# Altium project PMP20873E1.PrjPcb (part 2 of 4)

## Sheet PMP20873E1_Control.SchDoc: CONTROLLER
size 431 x 279 mm; Date: Not shown in title block; ApprovedBy: Not shown in title block; CheckedBy: Not shown in title block; Author: Not shown in title block; CompanyName: Not shown in title block; DrawnBy: Eric Faraci; Engineer: Not shown in title block; Organization: Not shown in title block; Address1: Not shown in title block; Address2: Not shown in title block; Address3: Not shown in title block; Address4: Not shown in title block; DocumentNumber: 3; Revision: Use project parameter SCH_Rev; SheetNumber: 3; SheetTotal: 8; PageSetup: Record=PageOptions|CenterHorizontal=True|CenterVertical=True|PrintScale=0.96|XCorrection=1.00|YCorrection=1.00|PrintKind=0|BorderSize=5000000|LeftOffset=0|BottomOffset=0|Orientation=2|PaperLength=1000|PaperWidth=1000|Scale=100|PaperSource=15|PrintQuality=600|MediaType=1|DitherType=10|PaperKind=11x17|PrintScaleMode=1; CurrentTime: Not shown in title block; CurrentDate: Not shown in title block; Time: Not shown in title block; DocumentFullPathAndName: Not shown in title block; DocumentName: Not shown in title block; ModifiedDate: Not shown in title block; ImagePath: Not shown in title block
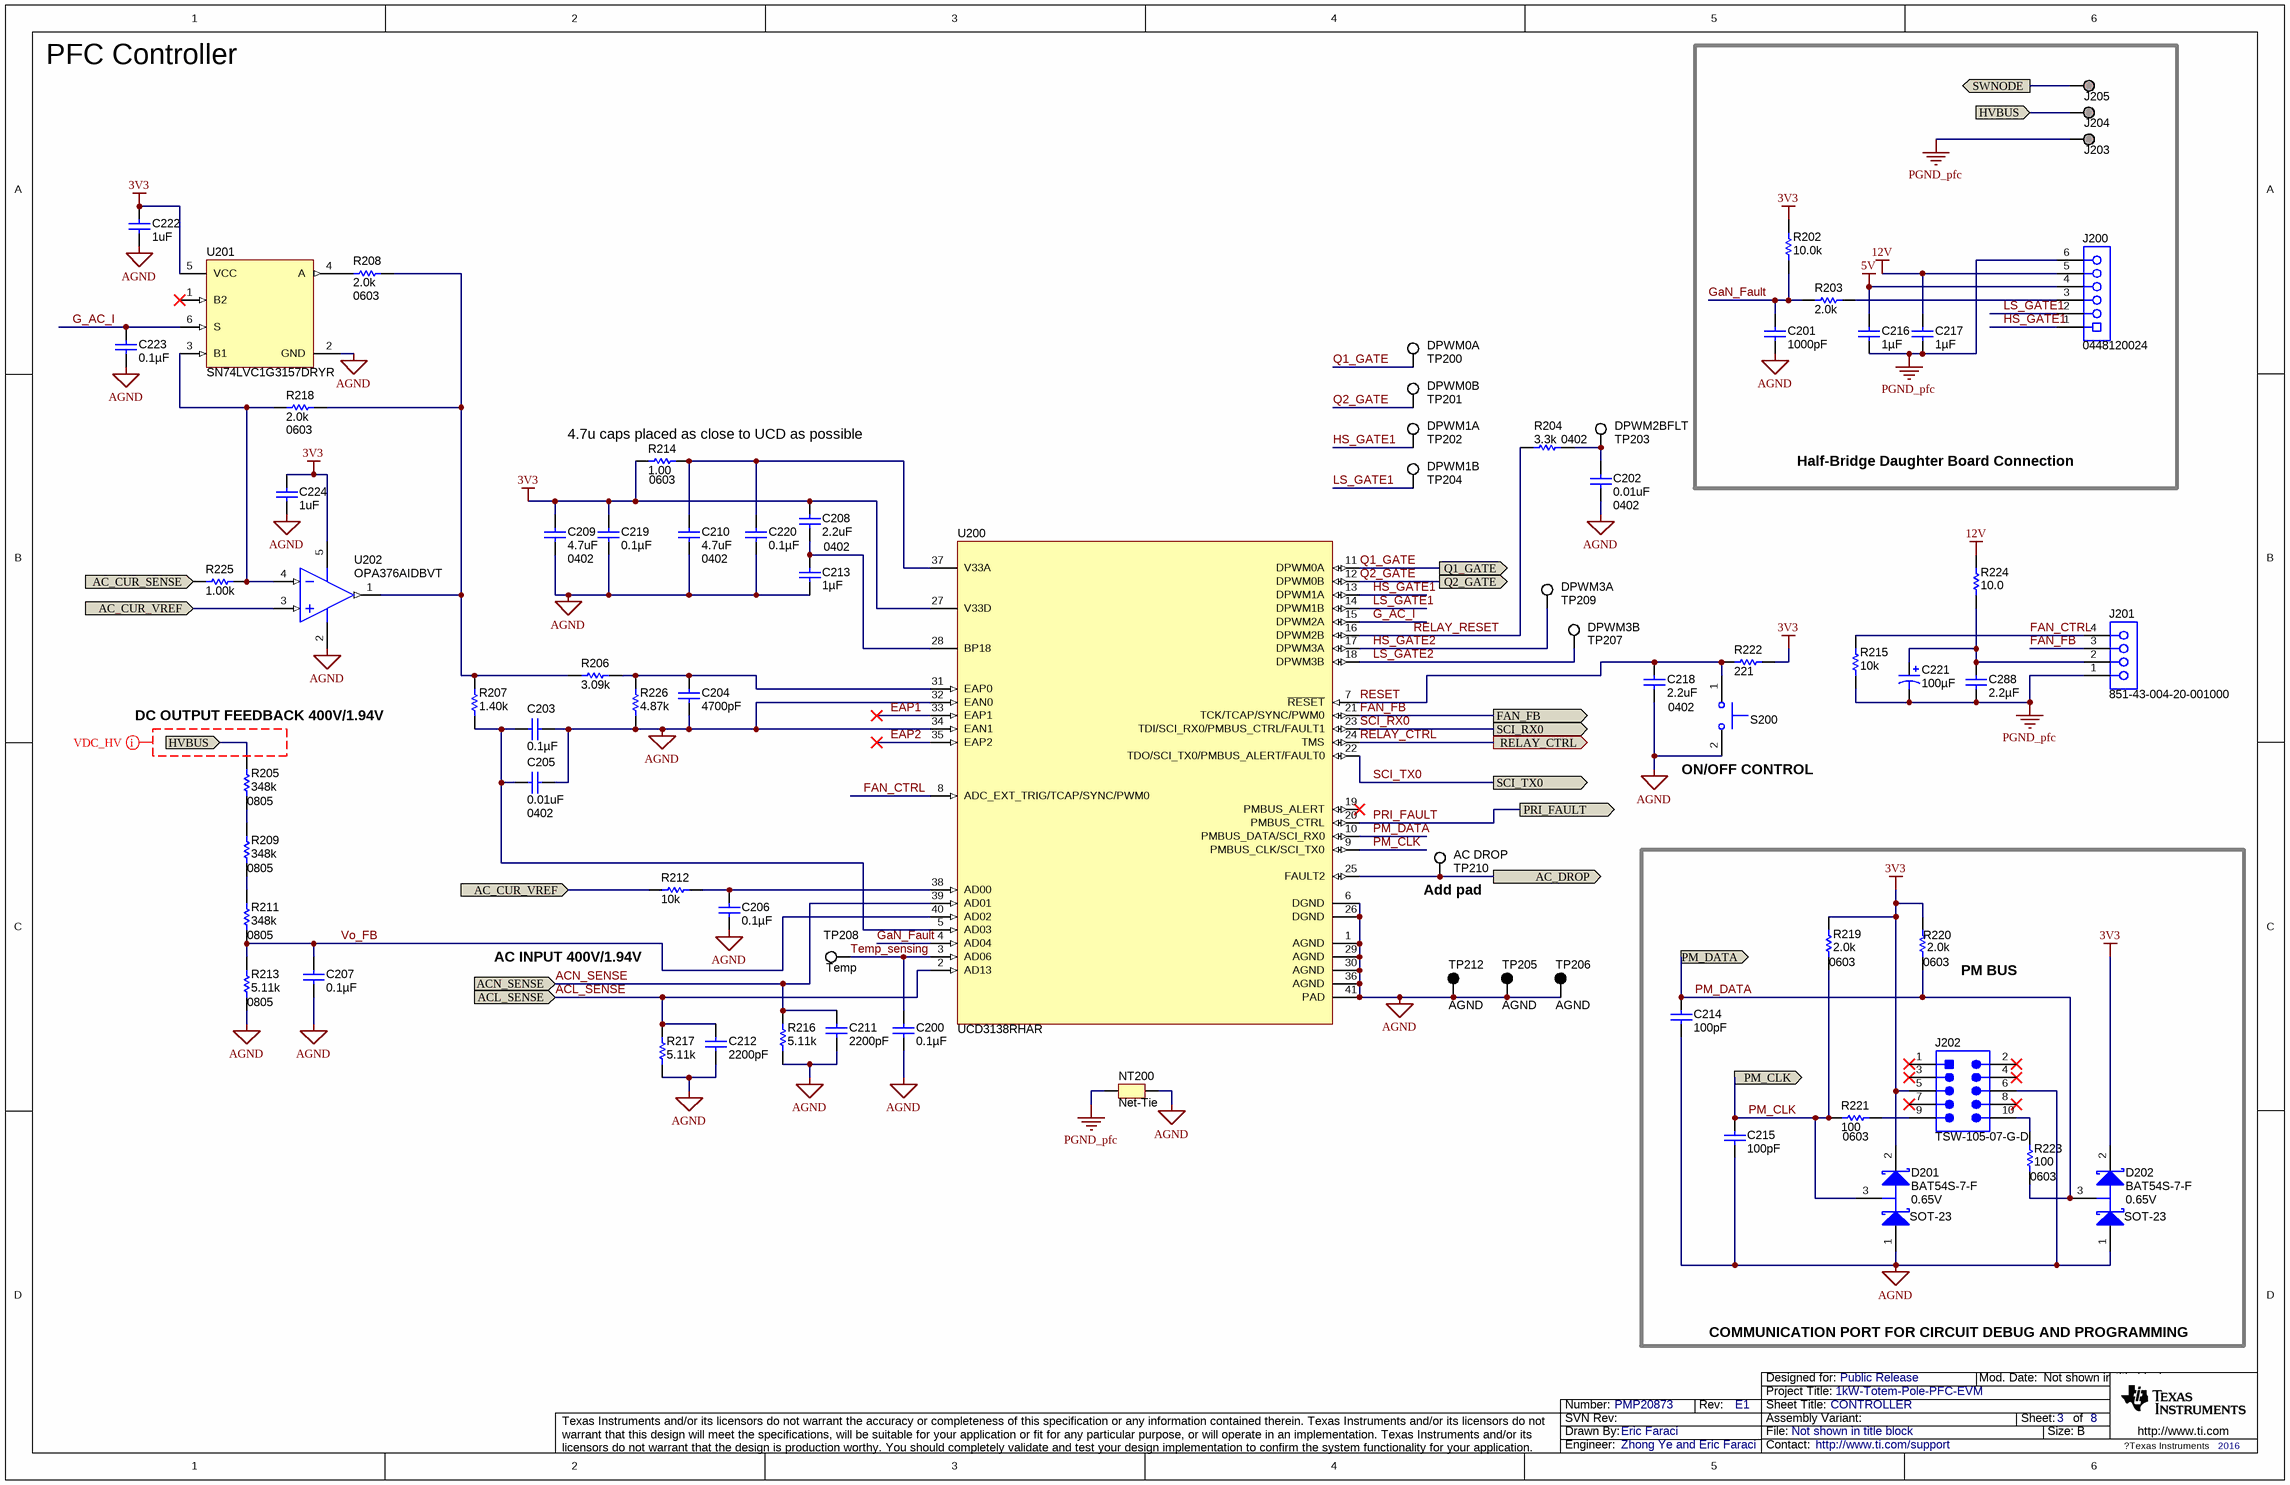
[diagram p1: PMP20873E1_Control.SchDoc]

### Parts
C200  ValueDisplayed: 0.1µF  [0402]  (hidden comment: GRM155R60J104KA01D)
C201  ValueDisplayed: 1000pF  [0402]  (hidden comment: GRM155R61A102KA01D)
C202  ValueDisplayed: 0.01uF  [0402]  (hidden comment: GRM155R70J103KA01D)
C203  ValueDisplayed: 0.1µF  [0402]  (hidden comment: GRM155R60J104KA01D)
C204  ValueDisplayed: 4700pF  [0402]  (hidden comment: GRM155R60J472KA01D)
C205  ValueDisplayed: 0.01uF  [0402]  (hidden comment: GRM155R70J103KA01D)
C206  ValueDisplayed: 0.1µF  [0402]  (hidden comment: GRM155R60J104KA01D)
C207  ValueDisplayed: 0.1µF  [0603]  (hidden comment: GCM188R71H104KA57D)
C208  ValueDisplayed: 2.2uF  [0402]  (hidden comment: C1005X5R1A225K050BC)
C209  value 4.7uF  [0402]  (hidden comment: CL05A475MQ5NRNC)
C210  value 4.7uF  [0402]  (hidden comment: CL05A475MQ5NRNC)
C211  ValueDisplayed: 2200pF  [0603]  (hidden comment: C1608X7R1H222K)
C212  ValueDisplayed: 2200pF  [0603]  (hidden comment: C1608X7R1H222K)
C213  ValueDisplayed: 1µF  [0402]  (hidden comment: GRM155R61A105KE15D)
C214  ValueDisplayed: 100pF  [0402]  (hidden comment: GRM1555C1H101JA01D)
C215  ValueDisplayed: 100pF  [0402]  (hidden comment: GRM1555C1H101JA01D)
C216  ValueDisplayed: 1µF  [0603]  (hidden comment: C1608X7R1E105K080AB)
C217  ValueDisplayed: 1µF  [0603]  (hidden comment: C1608X7R1E105K080AB)
C218  ValueDisplayed: 2.2uF  [0402]  (hidden comment: C1005X5R1A225K050BC)
C219  ValueDisplayed: 0.1µF  [0402]  (hidden comment: GRM155R60J104KA01D)
C220  ValueDisplayed: 0.1µF  [0402]  (hidden comment: GRM155R60J104KA01D)
C221  ValueDisplayed: 100µF  [7343-43]  (hidden comment: T495X107K016ATE100)
C222  ValueDisplayed: 1uF  [0603]  (hidden comment: C1608X7R1E105K080AB)
C223  ValueDisplayed: 0.1µF  [0603]  (hidden comment: GCM188R71H104KA57D)
C224  ValueDisplayed: 1uF  [0603]  (hidden comment: C1608X7R1E105K080AB)
C288  ValueDisplayed: 2.2µF  [1206]  (hidden comment: 12063D225KAT2A)
D201  BAT54S-7-F  value 0.65V  [SOT-23]
D202  BAT54S-7-F  value 0.65V  [SOT-23]
J200  0448120024  [Molex_0448120024]
J201  851-43-004-20-001000  [CONN_851-43-004-20-001000]
J202  TSW-105-07-G-D  [TSW-105-07-G-D]
J203  Suggest using a net name here  [Mill-Max_0312-0-15-15-34-27-10-0]  (value not drawn)
J204  Suggest using a net name here  [Mill-Max_0312-0-15-15-34-27-10-0]  (value not drawn)
J205  Suggest using a net name here  [Mill-Max_0312-0-15-15-34-27-10-0]  (value not drawn)
NT200  Net-Tie  [Net-Tie_50milWide_30milLong]  (net tie, no BOM)
R202  ValueDisplayed: 10.0k  [0402]  (hidden comment: ERJ-2RKF1002X)
R203  value 2.0k  [0402]  (hidden comment: CRCW04022K00JNED)
R204  value 3.3k  [0402]  (hidden comment: CRCW04023K30JNED)
R205  value 348k  PackageReference: 0805  [0805_HV]  (hidden comment: RT0805BRD07348KL)
R206  ValueDisplayed: 3.09k  [0402]  (hidden comment: ERA-2AEB3091X)
R207  value 1.40k  [0402]  (hidden comment: CRCW04021K40FKED)
R208  value 2.0k  [0603]  (hidden comment: CRCW06032K00JNEA)
R209  value 348k  PackageReference: 0805  [0805_HV]  (hidden comment: RT0805BRD07348KL)
R211  value 348k  PackageReference: 0805  [0805_HV]  (hidden comment: RT0805BRD07348KL)
R212  value 10k  [0402]  (hidden comment: CRCW040210K0JNED)
R213  value 5.11k  PackageReference: 0805  [0805_HV]  (hidden comment: RT0805BRD075K11L)
R214  value 1.00  [0603]  (hidden comment: CRCW06031R00FKEA)
R215  value 10k  [0402]  (hidden comment: CRCW040210K0JNED)
R216  ValueDisplayed: 5.11k  [0603]  (hidden comment: RT0603BRD075K11L)
R217  ValueDisplayed: 5.11k  [0603]  (hidden comment: RT0603BRD075K11L)
R218  value 2.0k  [0603]  (hidden comment: CRCW06032K00JNEA)
R219  value 2.0k  [0603]  (hidden comment: CRCW06032K00JNEA)
R220  value 2.0k  [0603]  (hidden comment: CRCW06032K00JNEA)
R221  value 100  [0603]  (hidden comment: CRCW0603100RJNEA)
R222  ValueDisplayed: 221  [0402]  (hidden comment: CRCW0402221RFKED)
R223  value 100  [0603]  (hidden comment: CRCW0603100RJNEA)
R224  ValueDisplayed: 10.0  [1206]  (hidden comment: ERJ-8ENF10R0V)
R225  ValueDisplayed: 1.00k  [0603]  (hidden comment: RC0603FR-071KL)
R226  ValueDisplayed: 4.87k  [0402]  (hidden comment: ERA-2AEB4871X)
S200  SKRKAEE010  [SW_SKRKAEE010]  (value not drawn)
TP200  DPWM0A  [Keystone5002]
TP201  DPWM0B  [Keystone5002]
TP202  DPWM1A  [Keystone5002]
TP203  DPWM2BFLT  [Keystone5002]
TP204  DPWM1B  [Keystone5002]
TP205  AGND  [Keystone5001]
TP206  AGND  [Keystone5001]
TP207  DPWM3B  [Keystone5002]
TP208  Temp  [Keystone5002]
TP209  DPWM3A  [Keystone5002]
TP210  AC DROP  [Keystone5002]
TP212  AGND  [Keystone5001]
U200  UCD3138RHAR  [RHA0040B]
U201  SN74LVC1G3157DRYR  [DRY0006A]
U202  OPA376AIDBVT  [DBV0005A_N]

### Blocks framed on the sheet
Half-Bridge Daughter Board Connection: C201 C216 C217 J200 J203-J205 R202 R203

### Ports
AC_CUR_SENSE, AC_CUR_VREF, AC_DROP, ACL_SENSE, ACN_SENSE, FAN_FB (out), HVBUS, PM_CLK, PM_DATA, PRI_FAULT (out), Q1_GATE (out), Q2_GATE (out), RELAY_CTRL (out), SCI_RX0 (out), SCI_TX0 (out), SWNODE

### Nets
3V3: C208.1 C209.1 C219.1 C222.2 C224.2 D201.2(K) D202.2(K) J202.5 R202.2 R214.2 R219.2 R220.2 R222.2 U200.27(V33D) U201.5(VCC) U202.5(V+)
5V: C216.2 J200.4
12V: C217.2 J200.5 R224.2
AGND: C200.1 C201.2 C202.1 C203.2 C204.2 C205.2 C206.1 C207.2 C209.2 C210.2 C211.2 C212.2 C213.2 C214.2 C215.2 C218.2 C219.2 C220.2 C222.1 C223.2 C224.1 D201.1(A) D202.1(A) J202.6 NT200.2 R213.1 R216.1 R217.1 R226.1 S200.2 TP205.1 TP206.1 TP212.1 U200.1(AGND) U200.6(DGND) U200.26(DGND) U200.29(AGND) U200.30(AGND) U200.32(EAN0) U200.34(EAN1) U200.36(AGND) U200.41(PAD) U201.2(GND) U202.2(V-)
PGND_pfc: C216.1 C217.1 C221.2(-) C288.1 J200.6 J201.1 J203.1 NT200.1 R215.1
AC_CUR_SENSE: R225.1 ; port AC_CUR_SENSE
AC_CUR_VREF: R212.2 U202.3(IN+) ; port AC_CUR_VREF
AC_DROP: TP210.1 U200.25(FAULT2) ; port AC_DROP
ACL_SENSE: C212.1 R217.2 U200.2(AD13) ; port ACL_SENSE
ACN_SENSE: C211.1 R216.2 U200.39(AD01) ; port ACN_SENSE
EAP1: U200.33(EAP1)
EAP2: U200.35(EAP2)
FAN_CTRL: J201.4 R215.2 U200.8(ADC_EXT_TRIG/TCAP/SYNC/PWM0)
FAN_FB: J201.3 U200.21(TCK/TCAP/SYNC/PWM0) ; port FAN_FB
G_AC_I: C223.1 U200.15(DPWM2A) U201.6(S)
GaN_Fault: C201.1 R202.1 R203.1 U200.4(AD04)
HS_GATE1: J200.1 TP202.1 U200.13(DPWM1A)
HS_GATE2: TP209.1 U200.17(DPWM3A)
HVBUS: J204.1 R205.2 ; port HVBUS
LS_GATE1: J200.2 TP204.1 U200.14(DPWM1B)
LS_GATE2: TP207.1 U200.18(DPWM3B)
PM_CLK: C215.1 D201.3(C) R219.1 R221.1 U200.9(PMBUS_CLK/SCI_TX0) ; port PM_CLK
PM_DATA: C214.1 D202.3(C) R220.1 R223.1 U200.10(PMBUS_DATA/SCI_RX0) ; port PM_DATA
PRI_FAULT: U200.20(PMBUS_CTRL) ; port PRI_FAULT
Q1_GATE: TP200.1 U200.11(DPWM0A) ; port Q1_GATE
Q2_GATE: TP201.1 U200.12(DPWM0B) ; port Q2_GATE
RELAY_CTRL: U200.24(TMS) ; port RELAY_CTRL
RELAY_RESET: R204.1 U200.16(DPWM2B)
RESET: C218.1 R222.1 S200.1 U200.7(~{RESET})
SCI_RX0: U200.23(TDI/SCI_RX0/PMBUS_CTRL/FAULT1) ; port SCI_RX0
SCI_TX0: U200.22(TDO/SCI_TX0/PMBUS_ALERT/FAULT0) ; port SCI_TX0
SWNODE: J205.1 ; port SWNODE
Temp_sensing: C200.2 TP208.1 U200.3(AD06)
Vo_FB: C207.1 R211.1 R213.2 U200.40(AD02)
NetC202_2: C202.2 R204.2 TP203.1
NetC203_1: C203.1 C205.1 R207.1 U200.5(AD03)
NetC204_1: C204.1 R206.2 R226.2 U200.31(EAP0)
NetC206_2: C206.2 R212.1 U200.38(AD00)
NetC208_2: C208.2 C213.1 U200.28(BP18)
NetC210_1: C210.1 C220.1 R214.1 U200.37(V33A)
NetC221_1: C221.1(+) C288.2 J201.2 R224.1
NetJ200_3: J200.3 R203.2
NetJ202_9: J202.9 R221.2
NetJ202_10: J202.10 R223.2
NetR205_1: R205.1 R209.2
NetR206_1: R206.1 R207.2 R208.1 R218.1 U202.1(OUT)
NetR208_2: R208.2 U201.4(A)
NetR209_1: R209.1 R211.2
NetR218_2: R218.2 R225.2 U201.3(B1) U202.4(IN-)

Not connected (* = marked no-connect by the designer): J202 1* 2* 3* 4* 7* 8*; U200 19(PMBUS_ALERT)*; U201 1(B2)*

### Layout directives
net class VDC_HV: (no net found under the mark)

### Notes on the sheet
- PFC Controller
- (near R214) 4.7u caps placed as close to UCD as possible
- (near R205) DC OUTPUT FEEDBACK 400V/1.94V
- (near S200) ON/OFF CONTROL
- (near TP210) Add pad
- AC INPUT 400V/1.94V
- (near R220) PM BUS
- COMMUNICATION PORT FOR CIRCUIT DEBUG AND PROGRAMMING
- Drawn By:
- SVN Rev:
- Number:
- Rev:
- Sheet Title:
- File:
- Project Title:
- Designed for:
- Assembly Variant:
- Mod. Date:
- Sheet:
- Size:
- of
- B
- http://www.ti.com
- Texas Instruments and/or its licensors do not warrant the accuracy or completeness of this specification or any information contained therein. Texas Instruments and/or its licensors do not warrant that this design will meet the specifications, will be suitable for your application or fit for any particular purpose, or will operate in an implementation. Texas Instruments and/or its licensors do not warrant that the design is production worthy. You should completely validate and test your design implementation to confirm the system functionality for your application.
- Engineer:
- Contact:
- ?Texas Instruments

### Library data of the parts
C200 C203 C206 C219 C220 = GRM155R60J104KA01D: CAP, CERM, 0.1uF, 6.3V, +/-10%, X5R, 0402; Manufacturer: MuRata; Polarized: N; CompType: Capacitor; U/M: EA; Cap_F: 0.0000001; Tolerance_%: 10; Value1: Unknown; VDC_V: 6.3; TaMin_C: -55; TaMax_C: 85; SymbolVersion: 2008-07-09; Value: 0.1uF; PartNumber: GRM155R60J104KA01D; PackageReference: 0402; RoHS: Y; Value2: 6.3V; MountType: SMT; Technology: Ceramic; TempCo: X5R; Cap_Case: 0402; Published: 2008-06-19; Publisher: Texas Instruments; LatestRevisionDate: 2014-04-30; ComponentLink1Description: Datasheet link; ComponentLink1URL: http://search.murata.co.jp/Ceramy/PnsearchViewAction.do?HnOFG=ON&HnNFG=ON&SEL_CNT=50&sLang=en&sKey=GRM155R60J104KA01D&x=9&y=9&search=startwith; Supplier 1: Digi-Key; Supplier Part Number 1: GRM155R60J104KA01D-ND; Supplier 2: Mouser; Supplier Part Number 2: 81-GRM155R60J104KA1D
C201 = GRM155R61A102KA01D: CAP, CERM, 1000pF, 10V, +/-10%, X5R, 0402; Manufacturer: MuRata; Polarized: N; CompType: Capacitor; U/M: EA; Cap_F: 0.000000001; Tolerance_%: 10; Value1: Unknown; TaMin_C: -55; TaMax_C: 85; SymbolVersion: 2008-07-09; Value: 1000pF; PartNumber: GRM155R61A102KA01D; PackageReference: 0402; RoHS: Y; VDC_V: 10; Value2: 10V; MountType: SMT; Technology: Ceramic; TempCo: X5R; Cap_Case: 0402; Published: 2008-06-19; Publisher: Texas Instruments; LatestRevisionDate: 2014-04-30; ComponentLink1Description: Datasheet link; ComponentLink1URL: http://search.murata.co.jp/Ceramy/PnsearchViewAction.do?HnOFG=ON&HnNFG=ON&SEL_CNT=50&sLang=en&sKey=GRM155R61A102KA01D&x=9&y=9&search=startwith; Supplier 1: Digi-Key; Supplier Part Number 1: GRM155R61A102KA01D-ND; Supplier 2: Mouser; Supplier Part Number 2: 81-GRM155R61A102KA1D
C202 C205 = GRM155R70J103KA01D: CAP, CERM, 0.01uF, 6.3V, +/-10%, X7R, 0402; Manufacturer: MuRata; Polarized: N; CompType: Capacitor; U/M: EA; Cap_F: 0.00000001; Tolerance_%: 10; Value1: Unknown; VDC_V: 6.3; TaMin_C: -55; TaMax_C: 125; SymbolVersion: 2008-07-09; Value: 0.01uF; PartNumber: GRM155R70J103KA01D; PackageReference: 0402; RoHS: Y; Value2: 6.3V; MountType: SMT; Technology: Ceramic; TempCo: X7R; Cap_Case: 0402; Published: 2008-06-19; Publisher: Texas Instruments; LatestRevisionDate: 2013-05-24; LatestRevisionNote: Changed publisher; ComponentLink1Description: Datasheet link; ComponentLink1URL: http://search.murata.co.jp/Ceramy/PnsearchViewAction.do?HnOFG=ON&HnNFG=ON&SEL_CNT=50&sLang=en&sKey=GRM155R70J103KA01D&x=9&y=9&search=startwith; Supplier 1: Digi-Key; Supplier Part Number 1: GRM155R70J103KA01D-ND; Supplier 2: Mouser; Supplier Part Number 2: 81-GRM155R70J103KA1D
C204 = GRM155R60J472KA01D: CAP, CERM, 4700pF, 6.3V, +/-10%, X5R, 0402; Manufacturer: MuRata; Polarized: N; CompType: Capacitor; U/M: EA; Cap_F: 0.0000000047; Tolerance_%: 10; Value1: Unknown; VDC_V: 6.3; TaMin_C: -55; TaMax_C: 85; SymbolVersion: 2008-07-09; Value: 4700pF; PartNumber: GRM155R60J472KA01D; PackageReference: 0402; RoHS: Y; Value2: 6.3V; MountType: SMT; Technology: Ceramic; TempCo: X5R; Cap_Case: 0402; Published: 2008-06-19; Publisher: Texas Instruments; LatestRevisionDate: 2014-04-30; ComponentLink1Description: Datasheet link; ComponentLink1URL: http://search.murata.co.jp/Ceramy/PnsearchViewAction.do?HnOFG=ON&HnNFG=ON&SEL_CNT=50&sLang=en&sKey=GRM155R60J472KA01D&x=9&y=9&search=startwith; Supplier 1: Digi-Key; Supplier Part Number 1: GRM155R60J472KA01D-ND; Supplier 2: Mouser; Supplier Part Number 2: 81-GRM155R60J472KA1D
C207 C223 = GCM188R71H104KA57D: CAP, CERM, 0.1 µF, 50 V, +/- 10%, X7R, 0603; Manufacturer: MuRata; Polarized: N; CompType: Capacitor; Value: 0.1uF; U/M: EA; Cap_F: 0.0000001; Tolerance_%: 10; ESR_ohm: 0.02; Value1: 0.02 ohm; VDC_V: 50; Value2: 50V; IRMS_A: 1.84; TaMin_C: -55; TaMax_C: 125; AEC Category: Q200; SymbolVersion: 2008-07-09; PartNumber: GCM188R71H104KA57D; PackageReference: 0603; RoHS: Y; MountType: SMT; Technology: Ceramic; TempCo: X7R; Cap_Case: 0603; Published: 2008-06-19; Publisher: Texas Instruments; LatestRevisionDate: 2015-12-09; ComponentLink1Description: Datasheet link; ComponentLink1URL: http://psearch.murata.com/capacitor/product/GCM188R71H104KA57%23.pdf; Supplier 1: Digi-Key; Supplier Part Number 1: 490-4779-1-ND; Supplier 2: Mouser; Supplier Part Number 2: 81-GCM188R71H104KA7D; AEC Qualified: ?
C208 C218 = C1005X5R1A225K050BC: CAP, CERM, 2.2uF, 10V, +/-10%, X5R, 0402; Manufacturer: TDK; Polarized: N; CompType: Capacitor; U/M: EA; Cap_F: 0.0000022; Tolerance_%: 10; Value1: Unknown; TaMin_C: -55; TaMax_C: 85; SymbolVersion: 2008-07-09; Value: 2.2uF; PartNumber: C1005X5R1A225K050BC; PackageReference: 0402; RoHS: Y; VDC_V: 10; Value2: 10V; MountType: SMT; Technology: Ceramic; TempCo: X5R; Cap_Case: 0402; Published: 2008-06-19; Publisher: Texas Instruments; LatestRevisionDate: 2013-05-24; LatestRevisionNote: Changed publisher; ComponentLink1Description: Datasheet link; ComponentLink1URL: http://www.tdk.com/pdf/TDKMLCCCapRange.pdf; Supplier 1: Digi-Key; Supplier Part Number 1: 445-7392-1-ND; Supplier 2: Newark; Supplier Part Number 2: 87R3267
C209 C210 = Capacitor: CAP, CER, 4.7UF, 6.3V, 20%, X5R, 0402; Manufacturer: Samsung Electro-Mechanics America; Polarized: N; U/M: EA; Tolerance_%: ?0%; CompType: Capacitor; SymbolVersion: 2008-07-09; PackageReference: 0402; PartNumber: CL05A475MQ5NRNC; RoHS: Y; MountType: SMT; ComponentLink1Description: Datasheet Link; ComponentLink1URL: Paste URL for datasheet here; Publisher: Texas Instruments; LatestRevisionDate: 2013-09-07; LatestRevisionNote: Added Alternate PartNumber and Alternate Manufacturer parameters to appropriate components.; Alternate Manufacturer: -; Alternate PartNumber: -; Supplier 1: Digi-Key; Supplier Part Number 1: 1276-1056-1-ND; Pricing 1: 1=0.23, 10=0.159, 25=0.116, 50=0.0966, 100=0.0811, 250=0.06564, 500=0.0579, 1000=0.04922, 2500=0.04536 (USD); Packaging: Cut Tape (CT); VDC_V: 6.3V; TempCo: X5R; Operating Temperature: -55°C ~ 85°C; Applications: General Purpose; Ratings: -; Size / Dimension: 0.039" L x 0.020" W (1.00mm x 0.50mm); Height - Seated (Max): -; Thickness (Max): 0.022" (0.55mm); Lead Spacing: -; Technology: -; ComponentLink2URL: http://www.samsungsem.com/servlet/FileDownload?type=spec&file=CL05A475MQ5NRNC.pdf; ComponentLink2Description: http://www.samsungsem.com/servlet/FileDownload?type=spec&file=CL05A475MQ5NRNC.pdf
C211 C212 = C1608X7R1H222K: CAP, CERM, 2200 pF, 50 V, +/- 10%, X7R, 0603; Manufacturer: TDK; Polarized: N; CompType: Capacitor; Value: 2200pF; U/M: EA; Cap_F: 0.0000000022; Tolerance_%: 10; ESR_ohm: 0.145; Value1: 0.145 ohm; VDC_V: 50; Value2: 50V; TaMin_C: -55; TaMax_C: 125; AEC Category: Q200; SymbolVersion: 2008-07-09; PartNumber: C1608X7R1H222K; PackageReference: 0603; RoHS: Y; MountType: SMT; Technology: Ceramic; TempCo: X7R; Cap_Case: 0603; Published: 2008-06-19; Publisher: Texas Instruments; LatestRevisionDate: 2015-10-11; ComponentLink1Description: Datasheet link; ComponentLink1URL: http://www.tdk.co.jp/tefe02/e412_c.pdf; Supplier 1: Digi-Key; Supplier Part Number 1: 445-1309-1-ND; Supplier 2: Farnell; Supplier Part Number 2: 1844244; AEC Qualified: ?
C213 = GRM155R61A105KE15D: CAP, CERM, 1uF, 10V, +/-10%, X5R, 0402; Manufacturer: MuRata; Polarized: N; CompType: Capacitor; U/M: EA; Cap_F: 0.000001; Tolerance_%: 10; Value1: Unknown; TaMin_C: -55; TaMax_C: 85; SymbolVersion: 2008-07-09; Value: 1uF; PartNumber: GRM155R61A105KE15D; PackageReference: 0402; RoHS: Y; VDC_V: 10; Value2: 10V; MountType: SMT; Technology: Ceramic; TempCo: X5R; Cap_Case: 0402; Published: 2008-06-19; Publisher: Texas Instruments; LatestRevisionDate: 2014-05-23; ComponentLink1Description: Datasheet link; ComponentLink1URL: http://search.murata.co.jp/Ceramy/PnsearchViewAction.do?HnOFG=ON&HnNFG=ON&SEL_CNT=50&sLang=en&sKey=GRM155R61A105KE15D&x=9&y=9&search=startwith; Supplier 1: Digi-Key; Supplier Part Number 1: 490-3890-1-ND; Supplier 2: Mouser; Supplier Part Number 2: 81-GRM155R61A105KE15; Supplier 3: Farnell; Supplier Part Number 3: 1735523
C214 C215 = GRM1555C1H101JA01D: CAP, CERM, 100pF, 50V, +/-5%, C0G/NP0, 0402; Manufacturer: MuRata; Polarized: N; CompType: Capacitor; U/M: EA; Cap_F: 0.0000000001; Tolerance_%: 5; Value1: Unknown; VDC_V: 50; TaMin_C: -55; TaMax_C: 125; SymbolVersion: 2008-07-09; Value: 100pF; PartNumber: GRM1555C1H101JA01D; PackageReference: 0402; RoHS: Y; Value2: 50V; MountType: SMT; Technology: Ceramic; TempCo: C0G/NP0; Cap_Case: 0402; Published: 2008-06-19; Publisher: Texas Instruments; LatestRevisionDate: 2013-05-24; LatestRevisionNote: Changed publisher; ComponentLink1Description: Datasheet link; ComponentLink1URL: http://search.murata.co.jp/Ceramy/PnsearchViewAction.do?HnOFG=ON&HnNFG=ON&SEL_CNT=50&sLang=en&sKey=GRM1555C1H101JA01D&x=9&y=9&search=startwith; Supplier 1: Mouser; Supplier Part Number 1: 81-GRM1555C1H101JA1D
C216 C217 = C1608X7R1E105K080AB: CAP, CERM, 1 µF, 25 V, +/- 10%, X7R, 0603; Manufacturer: TDK; Polarized: N; CompType: Capacitor; Value: 1uF; U/M: EA; Cap_F: 0.000001; Tolerance_%: 10; Value1: Unknown; VDC_V: 25; Value2: 25V; TaMin_C: -55; TaMax_C: 125; SymbolVersion: 2008-07-09; PartNumber: C1608X7R1E105K080AB; PackageReference: 0603; RoHS: Y; MountType: SMT; Technology: Ceramic; TempCo: X7R; Cap_Case: 0603; Published: 2008-06-19; Publisher: Texas Instruments; LatestRevisionDate: 2014-12-30; ComponentLink1Description: Datasheet link; ComponentLink1URL: http://www.tdk.com/pdf/TDKMLCCCapRange.pdf; Supplier 1: Digi-Key; Supplier Part Number 1: 445-5956-1-ND
C221 = T495X107K016ATE100: CAP, TA, 100 µF, 16 V, +/- 10%, 0.1 ohm, SMD; Manufacturer: Kemet; Polarized: Y; CompType: Capacitor; Value: 100uF; U/M: EA; Cap_F: 0.0001; Tolerance_%: 10; Value1: 0.1 ohm; VDC_V: 16; Value2: 16V; ESR_ohm: 0.1; IRMS_A: 1.156; TaMin_C: -55; TaMax_C: 125; Cap_Case: X; AEC Category: Q200; SymbolVersion: 2008-07-09; PartNumber: T495X107K016ATE100; PackageReference: 7343-43; RoHS: Y; MountType: SMT; Technology: TA; Series: T495; Publisher: Texas Instruments; LatestRevisionDate: 2015-12-04; LatestRevisionNote: Updated supplier links; ComponentLink1Description: Datasheet link; ComponentLink1URL: http://www.kemet.com/kemet/web/homepage/kechome.nsf/file/T495%20Series/$file/F3102_T495.pdf; Supplier 1: Digi-Key; Supplier Part Number 1: 399-3895-1-ND; Supplier 2: Mouser; Supplier Part Number 2: 80-T495X107K016; Supplier 3: Farnell; Supplier Part Number 3: 9229310; AEC Qualified: ?
C222 C224 = C1608X7R1E105K080AB: CAP, CERM, 1uF, 25V, +/-10%, X7R, 0603; Manufacturer: TDK; Polarized: N; CompType: Capacitor; U/M: EA; Cap_F: 0.000001; Tolerance_%: 10; Value1: Unknown; VDC_V: 25; TaMin_C: -55; TaMax_C: 125; SymbolVersion: 2008-07-09; Value: 1uF; PartNumber: C1608X7R1E105K080AB; PackageReference: 0603; RoHS: Y; Value2: 25V; MountType: SMT; Technology: Ceramic; TempCo: X7R; Cap_Case: 0603; Published: 2008-06-19; Publisher: Texas Instruments; LatestRevisionDate: 2013-05-24; LatestRevisionNote: Changed publisher; ComponentLink1Description: Datasheet link; ComponentLink1URL: http://www.tdk.com/pdf/TDKMLCCCapRange.pdf; Supplier 1: Digi-Key; Supplier Part Number 1: 445-5956-1-ND
C288 = 12063D225KAT2A: CAP, CERM, 2.2 µF, 25 V, +/- 10%, X5R, 1206; Manufacturer: AVX; Polarized: N; CompType: Capacitor; Value: 2.2uF; U/M: EA; Cap_F: 0.0000022; Tolerance_%: 10; ESR_ohm: 0.016; Value1: 0.016 ohm; VDC_V: 25; Value2: 25V; TaMin_C: -55; TaMax_C: 85; SymbolVersion: 2008-07-09; PartNumber: 12063D225KAT2A; PackageReference: 1206; RoHS: Y; MountType: SMT; Technology: Ceramic; TempCo: X5R; Cap_Case: 1206; Published: 2008-06-19; Publisher: Texas Instruments; LatestRevisionDate: 2014-12-11; ComponentLink1Description: Datasheet link; ComponentLink1URL: http://www.avx.com/docs/masterpubs/smccp.pdf; Supplier 1: Digi-Key; Supplier Part Number 1: 478-1569-1-ND; Supplier 2: Mouser; Supplier Part Number 2: 581-12063D225K; Supplier 3: Farnell; Supplier Part Number 3: 1395546
D201 D202 = BAT54S-7-F: Diode, Schottky, 30V, 0.2A, SOT-23; Manufacturer: Diodes Inc.; U/M: EA; Vf_V: 0.65; Io_A: 0.2; Vr_V: 30; TJmax_C: 125; SymbolVersion: 2008-12-08; CompType: Diode; PartNumber: BAT54S-7-F; MountType: SMT; RoHS: Y; PackageReference: SOT-23; Value1: 0.2A; Value2: 30V; Type: Schottky; Published: 2008-06-26; Publisher: Texas Instruments; LatestRevisionDate: 2013-05-24; ComponentLink1Description: Datasheet link; ComponentLink1URL: http://www.diodes.com/datasheets/ds11005.pdf; Supplier 1: Digi-Key; Supplier Part Number 1: BAT54S-FDICT-ND; Supplier 2: Mouser; Supplier Part Number 2: 621-BAT54S-F; Supplier 3: Farnell; Supplier Part Number 3: 1843723
J200 = 0448120024: Receptacle, 2.54mm, 6x1, Gold, TH; Manufacturer: Molex; SymbolCreator: a0411947; U/M: EA; SymbolVersion: 2013-12-22; PartNumber: 0448120024; PackageReference: Receptacle, 2.54mm, 6x1, TH; CompType: Receptacle; RoHS: Y; MountType: TH; ComponentLink1Description: Datasheet Link; ComponentLink1URL: http://www.molex.com/pdm_docs/sd/448120024_sd.pdf; Publisher: Texas Instruments; LatestRevisionDate: 2015-10-23; Supplier 1: Digi-Key; Supplier Part Number 1: WM18605-ND
J201 = 851-43-004-20-001000: SOCKET .050" GRID SIP 4 POS R/A, TH; Manufacturer: Mill-Max; SymbolCreator: a0411947; CompType: Header; U/M: EA; SymbolVersion: 2013-04-04; PartNumber: 851-43-004-20-001000; RoHS: Y; PackageReference: R/A 4x1 receptacle; MountType: TH; ComponentLink1Description: Datasheet Link; ComponentLink1URL: http://www.mill-max.com/images/products/pdf/metric/067M.pdf; Publisher: Texas Instruments; LatestRevisionDate: 2013-05-24; Supplier 1: Digi-Key; Supplier Part Number 1: ED90474-ND
J202 = TSW-105-07-G-D: Header, 100mil, 5x2, Gold, TH; Manufacturer: Samtec; SymbolCreator: a0412235; U/M: EA; SymbolVersion: 2013-12-22; PartNumber: TSW-105-07-G-D; PackageReference: 5x2 Header; ClassName: Header; CompType: Header; RoHS: Y; MountType: TH; ComponentLink1Description: Datasheet Link; ComponentLink1URL: http://samtec.com/ftppub/pdf/TSW_TH.PDF; Publisher: Texas Instruments; LatestRevisionDate: 2015-10-21; Supplier 1: Digi-Key; Supplier Part Number 1: SAM1028-05-ND
J203-J205 = 0312-0-15-15-34-27-10-0: Pin Receptacle, .032-.046" .075" Dia, Gold, TH; Manufacturer: Mill-Max; U/M: EA; SymbolVersion: 2010-10-20; PartNumber: 0312-0-15-15-34-27-10-0; PackageReference: Pin Receptacle; CompType: Pin Receptacle; RoHS: Y; MountType: TH; ComponentLink1Description: Datasheet Link; ComponentLink1URL: https://www.mill-max.com/products/datasheet/recpin/0312-0-15-15-34-27-10-0; Publisher: Texas Instruments; LatestRevisionDate: 2015-10-23; Supplier 1: Digi-Key; Supplier Part Number 1: 0312-015153427100-ND; Supplier 2: Mouser; Supplier Part Number 2: 575-0312015153427
NT200 = Net-Tie: Single point connection between nets.; SymbolCreator: codlsc; SymbolVersion: 2009-07-01; MountType: SMT; PackageReference: N/A; Publisher: Texas Instruments; LatestRevisionDate: 2015-10-18; LatestRevisionNote: Added Alternate PartNumber and Alternate Manufacturer parameters to appropriate components.
R202 = ERJ-2RKF1002X: RES, 10.0 k, 1%, 0.1 W, 0402; Manufacturer: Panasonic; CompType: Resistor; Value: 10.0k; Res_ohm: 10000; Value_Code: 10k0; Tolerance_%: 1; Power_W: 0.1; Value2: 0.1W; VDC_V: 50; TempCo: 100 ppm/C; EIA_Code: E96; U/M: EA; AEC Category: Q200; SymbolVersion: 2009-05-29; PartNumber: ERJ-2RKF1002X; PackageReference: 0402; RoHS: Y; Value1: 1%; MountType: SMT; Technology: Thick Film; Published: 2008-06-26; Publisher: Texas Instruments; LatestRevisionDate: 2015-10-23; ComponentLink1Description: Datasheet link; ComponentLink1URL: http://industrial.panasonic.com/www-data/pdf/AOA0000/AOA0000CE2.pdf; Supplier 1: Digi-Key; Supplier Part Number 1: P10.0KLCT-ND; Supplier 2: Mouser; Supplier Part Number 2: 667-ERJ-2RKF1002X; AEC Qualified: ?
R203 = CRCW04022K00JNED: RES, 2.0k ohm, 5%, 0.063W, 0402; Manufacturer: Vishay-Dale; CompType: Resistor; Res_ohm: 2000; Value_Code: 2k00; Tolerance_%: 5; Power_W: 0.063; VDC_V: 50; TempCo: 200 ppm/C; EIA_Code: E24; U/M: EA; SymbolVersion: 2009-05-29; PartNumber: CRCW04022K00JNED; PackageReference: 0402; RoHS: Y; Value1: 5%; Value2: 0.063W; MountType: SMT; Technology: Thick Film; Published: 2008-06-26; Publisher: Texas Instruments; LatestRevisionDate: 2013-11-01; ComponentLink1Description: Datasheet link; ComponentLink1URL: http://www.vishay.com/docs/20035/dcrcwe3.pdf; Supplier 1: Mouser; Supplier Part Number 1: 71-CRCW0402J-2K-E3; Supplier 2: Farnell; Supplier Part Number 2: 1514677; Supplier 3: Newark; Supplier Part Number 3: 59M6709
R204 = CRCW04023K30JNED: RES, 3.3k ohm, 5%, 0.063W, 0402; Manufacturer: Vishay-Dale; CompType: Resistor; Res_ohm: 3300; Value_Code: 3k30; Tolerance_%: 5; Power_W: 0.063; VDC_V: 50; TempCo: 200 ppm/C; EIA_Code: E24; U/M: EA; SymbolVersion: 2009-05-29; PartNumber: CRCW04023K30JNED; PackageReference: 0402; RoHS: Y; Value1: 5%; Value2: 0.063W; MountType: SMT; Technology: Thick Film; Published: 2008-06-26; Publisher: Texas Instruments; LatestRevisionDate: 2013-01-08; ComponentLink1Description: Datasheet link; ComponentLink1URL: http://www.vishay.com/docs/20035/dcrcwe3.pdf; Supplier 1: Digi-Key; Supplier Part Number 1: 541-3.3KJCT-ND; Supplier 2: Farnell; Supplier Part Number 2: 1514692; Supplier 3: Newark; Supplier Part Number 3: 59M6723
R205 R209 R211 = RT0805BRD07348KL: RES, 348k ohm, 0.1%, 0.125W, 0805; Manufacturer: Yageo America; CompType: Resistor; Res_ohm: 348000; Tolerance_%: 0.1; Power_W: 0.125; VDC_V: 150; TempCo: 25 ppm/C; EIA_Code: E192; U/M: EA; SymbolVersion: 2009-05-29; PartNumber: RT0805BRD07348KL; RoHS: Y; Value_Code: 348k; Value1: 0.1%; Value2: 0.125W; MountType: SMT; Technology: Thin Film; Published: 2008-06-26; Publisher: Texas Instruments; LatestRevisionDate: 2013-04-29; ComponentLink1Description: Datasheet link; ComponentLink1URL: http://www.yageo.com/pdf/PYu-RT_1-to-0.05_RoHS_L_3.pdf
R206 = ERA-2AEB3091X: RES, 3.09 k, 0.1%, 0.062 W, AEC-Q200 Grade 0, 0402; Manufacturer: Panasonic; CompType: Resistor; Value: 3.09k; Res_ohm: 3090; Value_Code: 3k09; Tolerance_%: 0.1; Power_W: 0.062; Value2: 0.062W; VDC_V: 25; TempCo: 25 ppm/C; EIA_Code: E192; U/M: EA; AEC Category: Q200; AEC Qualified: Y; AEC Grade: 0; SymbolVersion: 2009-05-29; PartNumber: ERA-2AEB3091X; PackageReference: 0402; RoHS: Y; Value1: 0.1%; MountType: SMT; Technology: Thin Film; Published: 2008-06-26; Publisher: Texas Instruments; LatestRevisionDate: 2016-03-18; ComponentLink1Description: Datasheet link; ComponentLink1URL: https://industrial.panasonic.com/cdbs/www-data/pdf/RDA0000/AOA0000C88.pdf; Supplier 1: Digi-Key; Supplier Part Number 1: P3.09KDCCT-ND; Supplier 2: Mouser; Supplier Part Number 2: 667-ERA-2AEB3091X; Supplier 3: Newark; Supplier Part Number 3: 49W8810
R207 = CRCW04021K40FKED: RES, 1.40k ohm, 1%, 0.063W, 0402; Manufacturer: Vishay-Dale; CompType: Resistor; Res_ohm: 1400; Value_Code: 1k40; Tolerance_%: 1; Power_W: 0.063; VDC_V: 50; TempCo: 100 ppm/C; EIA_Code: E96; U/M: EA; SymbolVersion: 2009-05-29; PartNumber: CRCW04021K40FKED; PackageReference: 0402; RoHS: Y; Value1: 1%; Value2: 0.063W; MountType: SMT; Technology: Thick Film; Published: 2008-06-26; Publisher: Texas Instruments; LatestRevisionDate: 2013-01-08; ComponentLink1Description: Datasheet link; ComponentLink1URL: http://www.vishay.com/docs/20035/dcrcwe3.pdf; Supplier 1: Digi-Key; Supplier Part Number 1: 541-1.40KLCT-ND; Supplier 2: Mouser; Supplier Part Number 2: 71-CRCW0402-1.4K-E3; Supplier 3: Farnell; Supplier Part Number 3: 1469664
R208 R218-R220 = CRCW06032K00JNEA: RES, 2.0k ohm, 5%, 0.1W, 0603; Manufacturer: Vishay-Dale; CompType: Resistor; Res_ohm: 2000; Value_Code: 2k00; Tolerance_%: 5; Power_W: 0.1; VDC_V: 75; TempCo: 200 ppm/C; EIA_Code: E24; U/M: EA; SymbolVersion: 2009-05-29; PartNumber: CRCW06032K00JNEA; PackageReference: 0603; RoHS: Y; Value1: 5%; Value2: 0.1W; MountType: SMT; Technology: Thick Film; Published: 2008-06-26; Publisher: Texas Instruments; LatestRevisionDate: 2013-01-08; ComponentLink1Description: Datasheet link; ComponentLink1URL: http://www.vishay.com/docs/20035/dcrcwe3.pdf; Supplier 1: Mouser; Supplier Part Number 1: 71-CRCW06032K00JNEA; Supplier 2: Farnell; Supplier Part Number 2: 1514727; Supplier 3: Newark; Supplier Part Number 3: 59M6775
R212 R215 = CRCW040210K0JNED: RES, 10k ohm, 5%, 0.063W, 0402; Manufacturer: Vishay-Dale; CompType: Resistor; Res_ohm: 10000; Value_Code: 10k0; Tolerance_%: 5; Power_W: 0.063; VDC_V: 50; TempCo: 200 ppm/C; EIA_Code: E24; U/M: EA; SymbolVersion: 2009-05-29; PartNumber: CRCW040210K0JNED; PackageReference: 0402; RoHS: Y; Value1: 5%; Value2: 0.063W; MountType: SMT; Technology: Thick Film; Published: 2008-06-26; Publisher: Texas Instruments; LatestRevisionDate: 2013-01-08; ComponentLink1Description: Datasheet link; ComponentLink1URL: http://www.vishay.com/docs/20035/dcrcwe3.pdf; Supplier 1: Digi-Key; Supplier Part Number 1: 541-10KJCT-ND; Supplier 2: Farnell; Supplier Part Number 2: 1514663; Supplier 3: Newark; Supplier Part Number 3: 59M6696
R213 = RT0805BRD075K11L: RES, 5.11k ohm, 0.1%, 0.125W, 0805; Manufacturer: Yageo America; CompType: Resistor; Res_ohm: 5110; Value_Code: 5k11; Tolerance_%: 0.1; Power_W: 0.125; VDC_V: 150; TempCo: 25 ppm/C; EIA_Code: E192; U/M: EA; SymbolVersion: 2009-05-29; PartNumber: RT0805BRD075K11L; RoHS: Y; Value1: 0.1%; Value2: 0.125W; MountType: SMT; Technology: Thin Film; Published: 2008-06-26; Publisher: Texas Instruments; LatestRevisionDate: 2013-04-29; ComponentLink1Description: Datasheet link; ComponentLink1URL: http://www.yageo.com/pdf/PYu-RT_1-to-0.05_RoHS_L_3.pdf; Supplier 1: Farnell; Supplier Part Number 1: 9982965
R214 = CRCW06031R00FKEA: RES, 1.00 ohm, 1%, 0.1W, 0603; Manufacturer: Vishay-Dale; CompType: Resistor; Res_ohm: 1; Value_Code: 1R00; Power_W: 0.1; VDC_V: 75; TempCo: 100 ppm/C; EIA_Code: E96; U/M: EA; SymbolVersion: 2009-05-29; PartNumber: CRCW06031R00FKEA; PackageReference: 0603; RoHS: Y; Tolerance_%: 1; Value1: 1%; Value2: 0.1W; MountType: SMT; Technology: Thick Film; Published: 2008-06-26; Publisher: Texas Instruments; LatestRevisionDate: 2013-01-08; ComponentLink1Description: Datasheet link; ComponentLink1URL: http://www.vishay.com/docs/20035/dcrcwe3.pdf; Supplier 1: Mouser; Supplier Part Number 1: 71-CRCW06031R00FKEA; Supplier 2: Farnell; Supplier Part Number 2: 1616871; Supplier 3: Newark; Supplier Part Number 3: 52K8059
R216 R217 = RT0603BRD075K11L: RES, 5.11 k, 0.1%, 0.1 W, 0603; Manufacturer: Yageo America; CompType: Resistor; Value: 5.11k; Res_ohm: 5110; Value_Code: 5k11; Tolerance_%: 0.1; Value2: 0.1W; VDC_V: 75; TempCo: 25 ppm/C; EIA_Code: E192; U/M: EA; AEC Category: Q200; SymbolVersion: 2009-05-29; PartNumber: RT0603BRD075K11L; PackageReference: 0603; RoHS: Y; Value1: 0.1%; Power_W: 0.1; MountType: SMT; Technology: Thin Film; Published: 2008-06-26; Publisher: Texas Instruments; LatestRevisionDate: 2015-12-05; ComponentLink1Description: Datasheet link; ComponentLink1URL: http://www.yageo.com/pdf/PYu-RT_1-to-0.05_RoHS_L_3.pdf; AEC Qualified: ?
R221 R223 = CRCW0603100RJNEA: RES, 100 ohm, 5%, 0.1W, 0603; Manufacturer: Vishay-Dale; CompType: Resistor; Value_Code: 100R; Tolerance_%: 5; Power_W: 0.1; VDC_V: 75; TempCo: 200 ppm/C; EIA_Code: E24; U/M: EA; SymbolVersion: 2009-05-29; PartNumber: CRCW0603100RJNEA; PackageReference: 0603; RoHS: Y; Res_ohm: 100; Value1: 5%; Value2: 0.1W; MountType: SMT; Technology: Thick Film; Published: 2008-06-26; Publisher: Texas Instruments; LatestRevisionDate: 2013-01-08; ComponentLink1Description: Datasheet link; ComponentLink1URL: http://www.vishay.com/docs/20035/dcrcwe3.pdf; Supplier 1: Digi-Key; Supplier Part Number 1: 541-100GCT-ND; Supplier 2: Mouser; Supplier Part Number 2: 71-CRCW0603J-100-E3; Supplier 3: Farnell; Supplier Part Number 3: 1514715
R222 = CRCW0402221RFKED: RES, 221, 1%, 0.063 W, 0402; Manufacturer: Vishay-Dale; CompType: Resistor; Value: 221; Value_Code: 221R; Tolerance_%: 1; Power_W: 0.063; Value2: 0.063W; VDC_V: 50; TempCo: 100 ppm/C; EIA_Code: E96; U/M: EA; AEC Category: Q200; SymbolVersion: 2009-05-29; PartNumber: CRCW0402221RFKED; PackageReference: 0402; RoHS: Y; Res_ohm: 221; Value1: 1%; MountType: SMT; Technology: Thick Film; Published: 2008-06-26; Publisher: Texas Instruments; LatestRevisionDate: 2015-10-23; ComponentLink1Description: Datasheet link; ComponentLink1URL: http://www.vishay.com/docs/20035/dcrcwe3.pdf; Supplier 1: Digi-Key; Supplier Part Number 1: 541-221LCT-ND; Supplier 2: Mouser; Supplier Part Number 2: 71-CRCW0402-221-E3; Supplier 3: Farnell; Supplier Part Number 3: 1151038; AEC Qualified: ?
R224 = ERJ-8ENF10R0V: RES, 10.0, 1%, 0.25 W, 1206; Manufacturer: Panasonic; CompType: Resistor; Value: 10.0; Res_ohm: 10; Value_Code: 10R0; Tolerance_%: 1; Power_W: 0.25; Value2: 0.25W; VDC_V: 200; TempCo: 100 ppm/C; EIA_Code: E96; U/M: EA; AEC Category: Q200; SymbolVersion: 2009-05-29; PartNumber: ERJ-8ENF10R0V; PackageReference: 1206; RoHS: Y; Value1: 1%; MountType: SMT; Technology: Thick Film; Published: 2008-06-26; Publisher: Texas Instruments; LatestRevisionDate: 2015-10-21; ComponentLink1Description: Datasheet link; ComponentLink1URL: http://www.panasonic.com/industrial/components/pdf/AOA0000CE2.pdf; Supplier 1: Digi-Key; Supplier Part Number 1: P10.0FCT-ND; Supplier 2: Farnell; Supplier Part Number 2: 1748406; AEC Qualified: ?
R225 = RC0603FR-071KL: RES, 1.00 k, 1%, 0.1 W, 0603; Manufacturer: Yageo America; CompType: Resistor; Value: 1.00k; Res_ohm: 1000; Value_Code: 1k00; Tolerance_%: 1; Power_W: 0.1; Value2: 0.1W; VDC_V: 150; TempCo: 200 ppm/C; EIA_Code: E96; U/M: EA; AEC Category: Q200; SymbolVersion: 2009-05-29; PartNumber: RC0603FR-071KL; PackageReference: 0603; RoHS: Y; Value1: 1%; MountType: SMT; Technology: Thick Film; Published: 2008-06-26; Publisher: Texas Instruments; LatestRevisionDate: 2015-12-05; ComponentLink1Description: Datasheet link; ComponentLink1URL: http://www.yageo.com/pdf/Pu-RC0603_51_PbFree_L_2.pdf; Supplier 1: Digi-Key; Supplier Part Number 1: 311-1.00KHRCT-ND; Supplier 2: Mouser; Supplier Part Number 2: 603-RC0603FR-071KL; Supplier 3: Farnell; Supplier Part Number 3: 9238484; AEC Qualified: ?
R226 = ERA-2AEB4871X: RES, 4.87 k, 0.1%, 0.062 W, AEC-Q200 Grade 0, 0402; Manufacturer: Panasonic; CompType: Resistor; Value: 4.87k; Res_ohm: 4870; Value_Code: 4k87; Tolerance_%: 0.1; Power_W: 0.062; Value2: 0.062W; VDC_V: 25; TempCo: 25 ppm/C; EIA_Code: E192; U/M: EA; AEC Category: Q200; AEC Qualified: Y; AEC Grade: 0; SymbolVersion: 2009-05-29; PartNumber: ERA-2AEB4871X; PackageReference: 0402; RoHS: Y; Value1: 0.1%; MountType: SMT; Technology: Thin Film; Published: 2008-06-26; Publisher: Texas Instruments; LatestRevisionDate: 2016-03-18; ComponentLink1Description: Datasheet link; ComponentLink1URL: https://industrial.panasonic.com/cdbs/www-data/pdf/RDA0000/AOA0000C88.pdf; Supplier 1: Digi-Key; Supplier Part Number 1: P4.87KDCCT-ND; Supplier 2: Mouser; Supplier Part Number 2: 667-ERA-2AEB4871X; Supplier 3: Newark; Supplier Part Number 3: 49W8878
S200 = SKRKAEE010: Switch, Push Button, SMD; Manufacturer: Alps; SymbolCreator: a0412235; Circuit: SPST-NO; VDC_V: 12; SwitchFunction: Off-Mom; PositionCount: 1; CurrentRating_mA: 50; SymbolVersion: 2012-10-29; PartNumber: SKRKAEE010; MountType: SMT; ComponentLink1Description: Web Page; ComponentLink1URL: http://www.alps.com/products/WebObjects/catalog.woa/E/HTML/Tact/SurfaceMount/SKRK/SKRKAEE010.html; RoHS: Y; Orientation: Vertical; CompType: Switch; PackageReference: 2.9x2x3.9mm SMD; Publisher: Texas Instruments; LatestRevisionDate: 2015-11-30; Supplier 1: Mouser; Supplier Part Number 1: 688-SKRKAE
TP200-TP204 TP207-TP210 = 5002: Test Point, Miniature, White, TH; Manufacturer: Keystone; CompType: Test Point Loop; U/M: EA; SymbolVersion: 2008-04-04; PartNumber: 5002; PackageReference: White Miniature Testpoint; RoHS: Y; MountType: TH; ComponentLink1Description: Datasheet Link; ComponentLink1URL: http://www.keyelco.com/userAssets/file/M60-2p60.pdf; Value: White; Publisher: Texas Instruments; LatestRevisionDate: 2015-08-25; Supplier 1: Digi-Key; Supplier Part Number 1: 36-5002-ND; Supplier 2: Newark; Supplier Part Number 2: 82H9632
TP205 TP206 TP212 = 5001: Test Point, Miniature, Black, TH; Manufacturer: Keystone; CompType: Test Point Loop; U/M: EA; SymbolVersion: 2008-04-04; PartNumber: 5001; Value: Black; PackageReference: Black Miniature Testpoint; RoHS: Y; MountType: TH; ComponentLink1Description: Datasheet Link; ComponentLink1URL: http://www.keyelco.com/userAssets/file/M60-2p60.pdf; Publisher: Texas Instruments; LatestRevisionDate: 2013-09-19; Supplier 1: Digi-Key; Supplier Part Number 1: 5001K-ND
U200 = UCD3138RHAR: Highly Integrated Digital Controller for Isolated Power, RHA0040B; Alternate PartNumber: UCD3138RHAT; Manufacturer: Texas Instruments; SymbolCreator: Altium; CompType: IC; U/M: EA; SymbolVersion: 2014-10-30; PartNumber: UCD3138RHAR; PackageReference: RHA0040B; MountType: SMT; ComponentLink1Description: Datasheet Link; ComponentLink1URL: http://www.ti.com/lit/ds/symlink/ucd3138.pdf; RoHS: Y; Publisher: Texas Instruments; LatestRevisionDate: 2015-11-05; Alternate Manufacturer: Texas Instruments
U201 = SN74LVC1G3157DRYR: SINGLE-POLE DOUBLE-THROW ANALOG SWITCH, DRY0006A; Manufacturer: Texas Instruments; SymbolCreator: a0799628; CompType: IC; U/M: EA; SymbolVersion: 2014-05-28; PartNumber: SN74LVC1G3157DRYR; PackageReference: DRY0006A; MountType: SMT; ComponentLink1Description: Datasheet Link; ComponentLink1URL: http://www.ti.com/lit/ds/symlink/sn74lvc1g3157.pdf; RoHS: Y; Publisher: Texas Instruments; LatestRevisionDate: 2015-12-08; Alternate Manufacturer: Texas Instruments
U202 = OPA376AIDBVT: Precision, Low Noise, Low Iq Operational Amplifier, 2.2 to 5.5 V, -40 to 125 degC, 5-pin SOT23 (DBV0005A), Green (RoHS & no Sb/Br); Manufacturer: Texas Instruments; Alternate PartNumber: Equivalent; CMRR(Min)(dB): 76; IIB(Max)(pA): 10; Iq per channel(Max)(mA): 0.95; Number of Channels: 1; Offset Drift(Typ)(uV/C): 0.32; Slew Rate(Typ)(V/us): 2; Sub Family: Low Input Bias Current Amp (<=10pA), Low Noise Amp (<=10nV/rtHz), Low Offset Voltage Amplifier (<=500uV), Low Supply Voltage Amplifier (<=2.7V), Precision Amplifier; Total Supply Voltage(Max)(+5V is 5, +/-5V is 10): 5.5; Total Supply Voltage(Min)(+5V is 5, +/-5V is 10): 2.2; Vio (25C)(Max)(mV): 0.025; Vn at 1kHz(Typ)(nV/rtHz): 7.5; DatasheetVersion: SBOS406F; PackageVersion: 4073253-4/K, 03/2006; PackageReference: DBV0005A; PackageDescription: 5-Pin Plastic Small Outline, Body 1.6 x 2.9 mm, Pitch 0.95 mm; Supplier 1: Digi-Key; Supplier Part Number 1: 296-21982-2-ND; Supplier 2: Digi-Key; Supplier Part Number 2: 296-21982-1-ND; Supplier 3: Digi-Key; Supplier Part Number 3: 296-21982-6-ND; Supplier 4: Farnell; Supplier Part Number 4: 1427620; Supplier 5: Newark; Supplier Part Number 5: 50M8882; Supplier 6: Mouser; Supplier Part Number 6: 595-OPA376AIDBVT; Eco-Plan: Green (RoHS & no Sb/Br); MountType: SMT; Code_JEDEC: MO-178; PartNumber: OPA376AIDBVT; ComponentLink1Description: Manufacturer URL; ComponentLink1URL: http://www.ti.com/; ComponentLink2Description: Datasheet; ComponentLink2URL: http://www.ti.com/general/docs/lit/getliterature.tsp?genericPartNumber=OPA376&fileType=pdf; ComponentLink3Description: Package Specification; ComponentLink3URL: http://www.ti.com/litv/pdf/mpds018i; Alternate Manufacturer: Texas Instruments

## Sheet PMP20873E1_Hardware.SchDoc
size 431 x 279 mm; Date: Not shown in title block; ApprovedBy: Not shown in title block; CheckedBy: Not shown in title block; Author: Not shown in title block; CompanyName: Not shown in title block; Engineer: Not shown in title block; Organization: Not shown in title block; Address1: Not shown in title block; Address2: Not shown in title block; Address3: Not shown in title block; Address4: Not shown in title block; DocumentNumber: 1; Revision: Use project parameter SCH_Rev; SheetNumber: 3; SheetTotal: 3; PageSetup: Record=PageOptions|CenterHorizontal=True|CenterVertical=True|PrintScale=1.00|XCorrection=1.00|YCorrection=1.00|PrintKind=0|BorderSize=5000000|LeftOffset=0|BottomOffset=0|Orientation=2|PaperLength=1000|PaperWidth=1000|Scale=100|PaperSource=15|PrintQuality=600|MediaType=1|DitherType=10|PaperKind=Letter|PrintScaleMode=1; CurrentTime: Not shown in title block; CurrentDate: Not shown in title block; Time: Not shown in title block; DocumentFullPathAndName: Not shown in title block; DocumentName: Not shown in title block; ModifiedDate: Not shown in title block; ImagePath: Not shown in title block
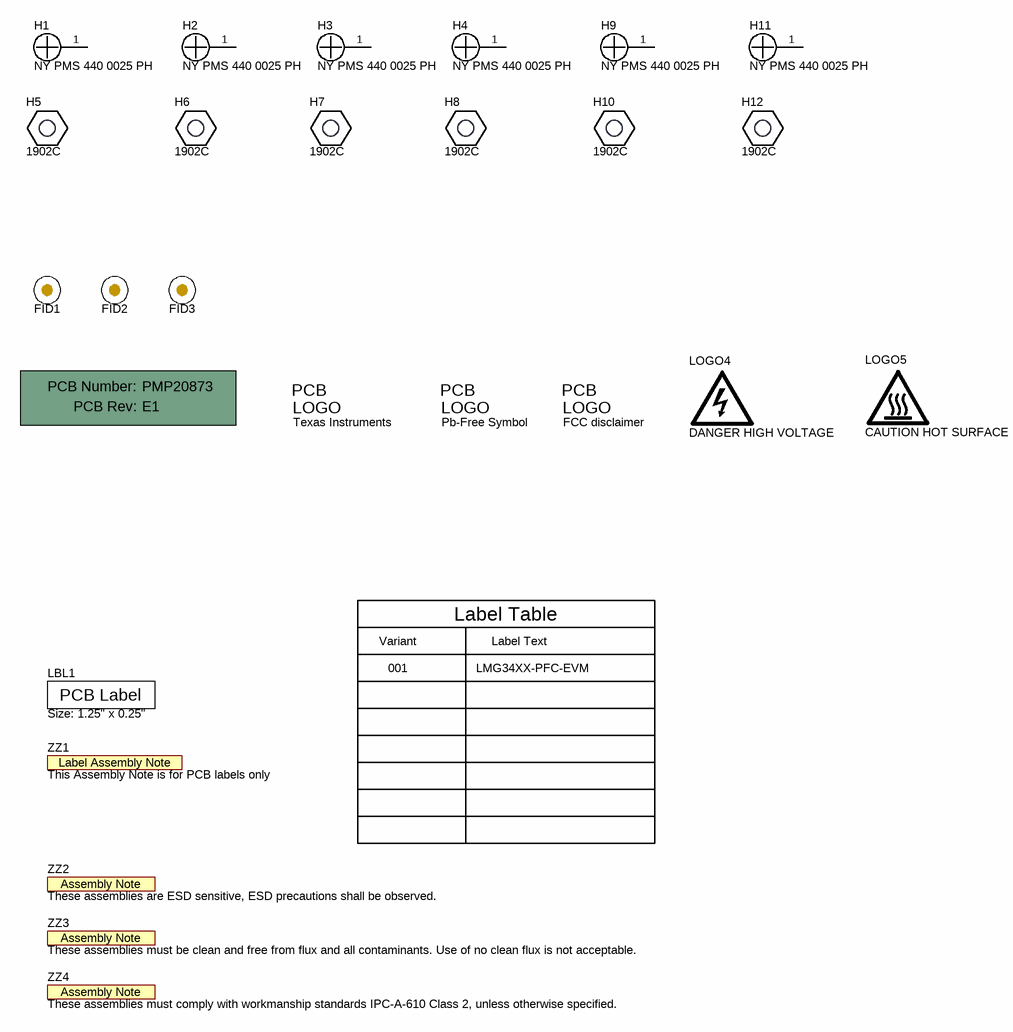
[diagram p2: PMP20873E1_Hardware.SchDoc]

### Parts
!PCB  Printed Circuit Board  (value not drawn)  (mechanical)
FID1  Fiducial  [Fiducial10-20]  (value not drawn)
FID2  Fiducial  [Fiducial10-20]  (value not drawn)
FID3  Fiducial  [Fiducial10-20]  (value not drawn)
H1  NY PMS 440 0025 PH  [NY PMS 440 0025 PH]
H2  NY PMS 440 0025 PH  [NY PMS 440 0025 PH]
H3  NY PMS 440 0025 PH  [NY PMS 440 0025 PH]
H4  NY PMS 440 0025 PH  [NY PMS 440 0025 PH]
H5  1902C  [Keystone_1902C]
H6  1902C  [Keystone_1902C]
H7  1902C  [Keystone_1902C]
H8  1902C  [Keystone_1902C]
H9  NY PMS 440 0025 PH  [NY PMS 440 0025 PH]
H10  1902C  [Keystone_1902C]
H11  NY PMS 440 0025 PH  [NY PMS 440 0025 PH]
H12  1902C  [Keystone_1902C]
LBL1  Size: 1.25" x 0.25"  [Label_1250x250]
Logo1  Texas Instruments  [TI_Stacked_Overlay_Small]  (no BOM)
Logo2  Pb-Free Symbol  [Pb-Free_Overlay_Small]  (no BOM)
Logo3  FCC disclaimer  [FCC_disclaimer]  (no BOM)
LOGO4  DANGER HIGH VOLTAGE  [IEC_HighVoltage_Small]  (no BOM)
LOGO5  CAUTION HOT SURFACE  [IEC_HotSurface_Small]  (no BOM)
ZZ1  This Assembly Note is for PCB labels only  [AssemblyNoteLabel]  (no BOM)
ZZ2  These assemblies are ESD sensitive, ESD precautions shall be observed.  [AssemblyNote]  (no BOM)
ZZ3  These assemblies must be clean and free from flux and all contaminants. Use of no clean flux is not acceptable.  [AssemblyNote]  (no BOM)
ZZ4  These assemblies must comply with workmanship standards IPC-A-610 Class 2, unless otherwise specified.  [AssemblyNote]  (no BOM)

### Nets

Not connected (* = marked no-connect by the designer): H1 1; H2 1; H3 1; H4 1; H9 1; H11 1

### Notes on the sheet
- Variant
- Label Table
- Label Text
- 001
- LMG34XX-PFC-EVM
- Drawn By:
- SVN Rev:
- Number:
- TID #:
- Orderable:
- Rev:
- Sheet Title:
- File:
- Project Title:
- Designed for:
- Assembly Variant:
- Mod. Date:
- Sheet:
- Size:
- of
- B
- http://www.ti.com
- Texas Instruments and/or its licensors do not warrant the accuracy or completeness of this specification or any information contained therein. Texas Instruments and/or its licensors do not warrant that this design will meet the specifications, will be suitable for your application or fit for any particular purpose, or will operate in an implementation. Texas Instruments and/or its licensors do not warrant that the design is production worthy. You should completely validate and test your design implementation to confirm the system functionality for your application.
- Engineer:
- Contact:
- © Texas Instruments
- (in symbol AssemblyNote) Assembly Note
- (in symbol AssemblyNoteLabel) Label Assembly Note
- (in symbol FCC_disclaimer) PCB; LOGO
- (in symbol Pb-Free) PCB; LOGO
- (in symbol PCB) PCB Number:; PCB Rev:
- (in symbol THT-13-457-10) PCB Label
- (in symbol TI_Logo) PCB; LOGO

### Library data of the parts
!PCB = PCB: Manufacturer: Any; PartNumber: PMP20873; SymbolCreator: a0412235; SymbolVersion: 2012-05-30; CompType: PCB; RoHS: O; MountType: N/A; Publisher: Texas Instruments; LatestRevisionDate: 2012-06-27; LatestRevisionNote: Initial Version; Alternate Manufacturer: -; Alternate PartNumber: -
FID1-FID3 = Fiducial: Fiducial mark.  There is nothing to buy or mount.; SymbolCreator: codlsc; SymbolVersion: 2009-11-4; CompType: Fiducial; Publisher: Texas Instruments; LatestRevisionDate: 2014-08-01; LatestRevisionNote: Added Alternate PartNumber and Alternate Manufacturer parameters to appropriate components.; Manufacturer: N/A; MountType: N/A; PackageReference: Fiducial; PartNumber: N/A; ClassName: FiducialMark
H1-H4 H9 H11 = NY PMS 440 0025 PH: Machine Screw, Round, #4-40 x 1/4, Nylon, Philips panhead; Manufacturer: B&F Fastener Supply; CompType: Hardware; SymbolCreator: codlsc; U/M: EA; SymbolVersion: 2009-10-28; MountType: N/A; RoHS: Y; PartNumber: NY PMS 440 0025 PH; PackageReference: Screw; DigiKeyPartNumber: H542-ND; ComponentLink1Description: Datasheet Link; ComponentLink1URL: http://www.fasnetdirect.com/refguide/Nylpanms.pdf; ClassName: Mounting Holes; LatestRevisionDate: 2015-07-23; Publisher: Texas Instruments; Supplier 1: Digi-Key; Supplier Part Number 1: H542-ND
H5-H8 H10 H12 = 1902C: Standoff, Hex, 0.5"L #4-40 Nylon; Manufacturer: Keystone; CompType: Hardware; MountType: N/A; RoHS: Y; PartNumber: 1902C; PackageReference: Standoff; ComponentLink1Description: Datasheet Link; ComponentLink1URL: http://www.keyelco.com/pdfs/M55-prod31.pdf; Alternate Manufacturer: -; Alternate PartNumber: -; LatestRevisionDate: 2012-06-27; LatestRevisionNote: Initial Version; Publisher: Texas Instruments; Supplier 1: Digi-Key; Supplier Part Number 1: 1902CK-ND
LBL1 = THT-13-457-10: Thermal Transfer Printable Labels, 1.250" W x 0.250" H - 10,000 per roll; Manufacturer: Brady; SymbolCreator: a0412235; CompType: Label; SymbolVersion: 2012-06-12; ClassName: Label; PartNumber: THT-13-457-10; RoHS: Y; PackageReference: PCB Label 1.25"H x 0.250"W; MountType: N/A; ComponentLink1Description: Web Page; ComponentLink1URL: http://www.bradyid.com/bradyid/pdpv/THT-13-457-10.html; Note: Size: 1.25" x 0.25"; Publisher: Texas Instruments; LatestRevisionDate: 2015-11-10; Supplier 1: Newark; Supplier Part Number 1: 04H3909
Logo1 = TI_Logo: Texas Instrument Corporate Signature; SymbolCreator: codlsc; SymbolVersion: 2011-08-22; Published: 2009-03-03; Publisher: National Semiconductor; ClassName: Logo; LatestRevisionDate: 2011-10-25; LatestRevisionNote: Added ClassName of Logo.
Logo2 = Pb-Free: SymbolCreator: a0412235; SymbolVersion: 2011-08-22; Published: 2009-03-03; Publisher: Texas Instruments; LatestRevisionDate: 2014-08-05
Logo3 = FCC_disclaimer: SymbolCreator: codlsc; SymbolVersion: 2011-08-22; Published: 2009-03-03; Publisher: Texas Instruments; LatestRevisionDate: 2014-11-20
LOGO4 = IEC_HighVoltage: IEC 61010-1 High Voltage Warning; SymbolCreator: a0412235; SymbolVersion: 2011-08-22; Published: 2009-03-03; Publisher: Texas Instruments; LatestRevisionDate: 2014-11-20
LOGO5 = IEC_HotSurface: IEC 61010-1 Hot Surface Warning; SymbolCreator: a0412235; SymbolVersion: 2011-08-22; Published: 2009-03-03; Publisher: Texas Instruments; LatestRevisionDate: 2014-11-20
ZZ1 = AssemblyNoteLabel: SymbolCreator: a0412235; SymbolVersion: 2012-06-14; CompType: AssemblyNote; ClassName: AssemblyNote; Publisher: Texas Instruments; LatestRevisionDate: 2012-07-31; LatestRevisionNote: Initial Version; Alternate Manufacturer: -; Alternate PartNumber: -
ZZ2-ZZ4 = AssemblyNote: SymbolCreator: codlsc; SymbolVersion: 2010-05-18; CompType: AssemblyNote; ClassName: AssemblyNote; Publisher: Texas Instruments; LatestRevisionDate: 2012-06-14; LatestRevisionNote: Initial Version; Alternate Manufacturer: -; Alternate PartNumber: -

## Sheet PMP20873E1_Power.SchDoc: POWER STAGE
size 431 x 279 mm; Date: Not shown in title block; ApprovedBy: Not shown in title block; CheckedBy: Not shown in title block; Author: Not shown in title block; CompanyName: Not shown in title block; DrawnBy: Eric Faraci; Engineer: Not shown in title block; Organization: Not shown in title block; Address1: Not shown in title block; Address2: Not shown in title block; Address3: Not shown in title block; Address4: Not shown in title block; DocumentNumber: 1; Revision: E1; SheetNumber: 2; SheetTotal: 8; PageSetup: Record=PageOptions|CenterHorizontal=True|CenterVertical=True|PrintScale=0.96|XCorrection=1.00|YCorrection=1.00|PrintKind=0|BorderSize=5000000|LeftOffset=0|BottomOffset=0|Orientation=2|PaperLength=1000|PaperWidth=1000|Scale=100|PaperSource=15|PrintQuality=600|MediaType=1|DitherType=10|PaperKind=11x17|PrintScaleMode=1; CurrentTime: Not shown in title block; CurrentDate: Not shown in title block; Time: Not shown in title block; DocumentFullPathAndName: Not shown in title block; DocumentName: Not shown in title block; ModifiedDate: Not shown in title block; ImagePath: Not shown in title block
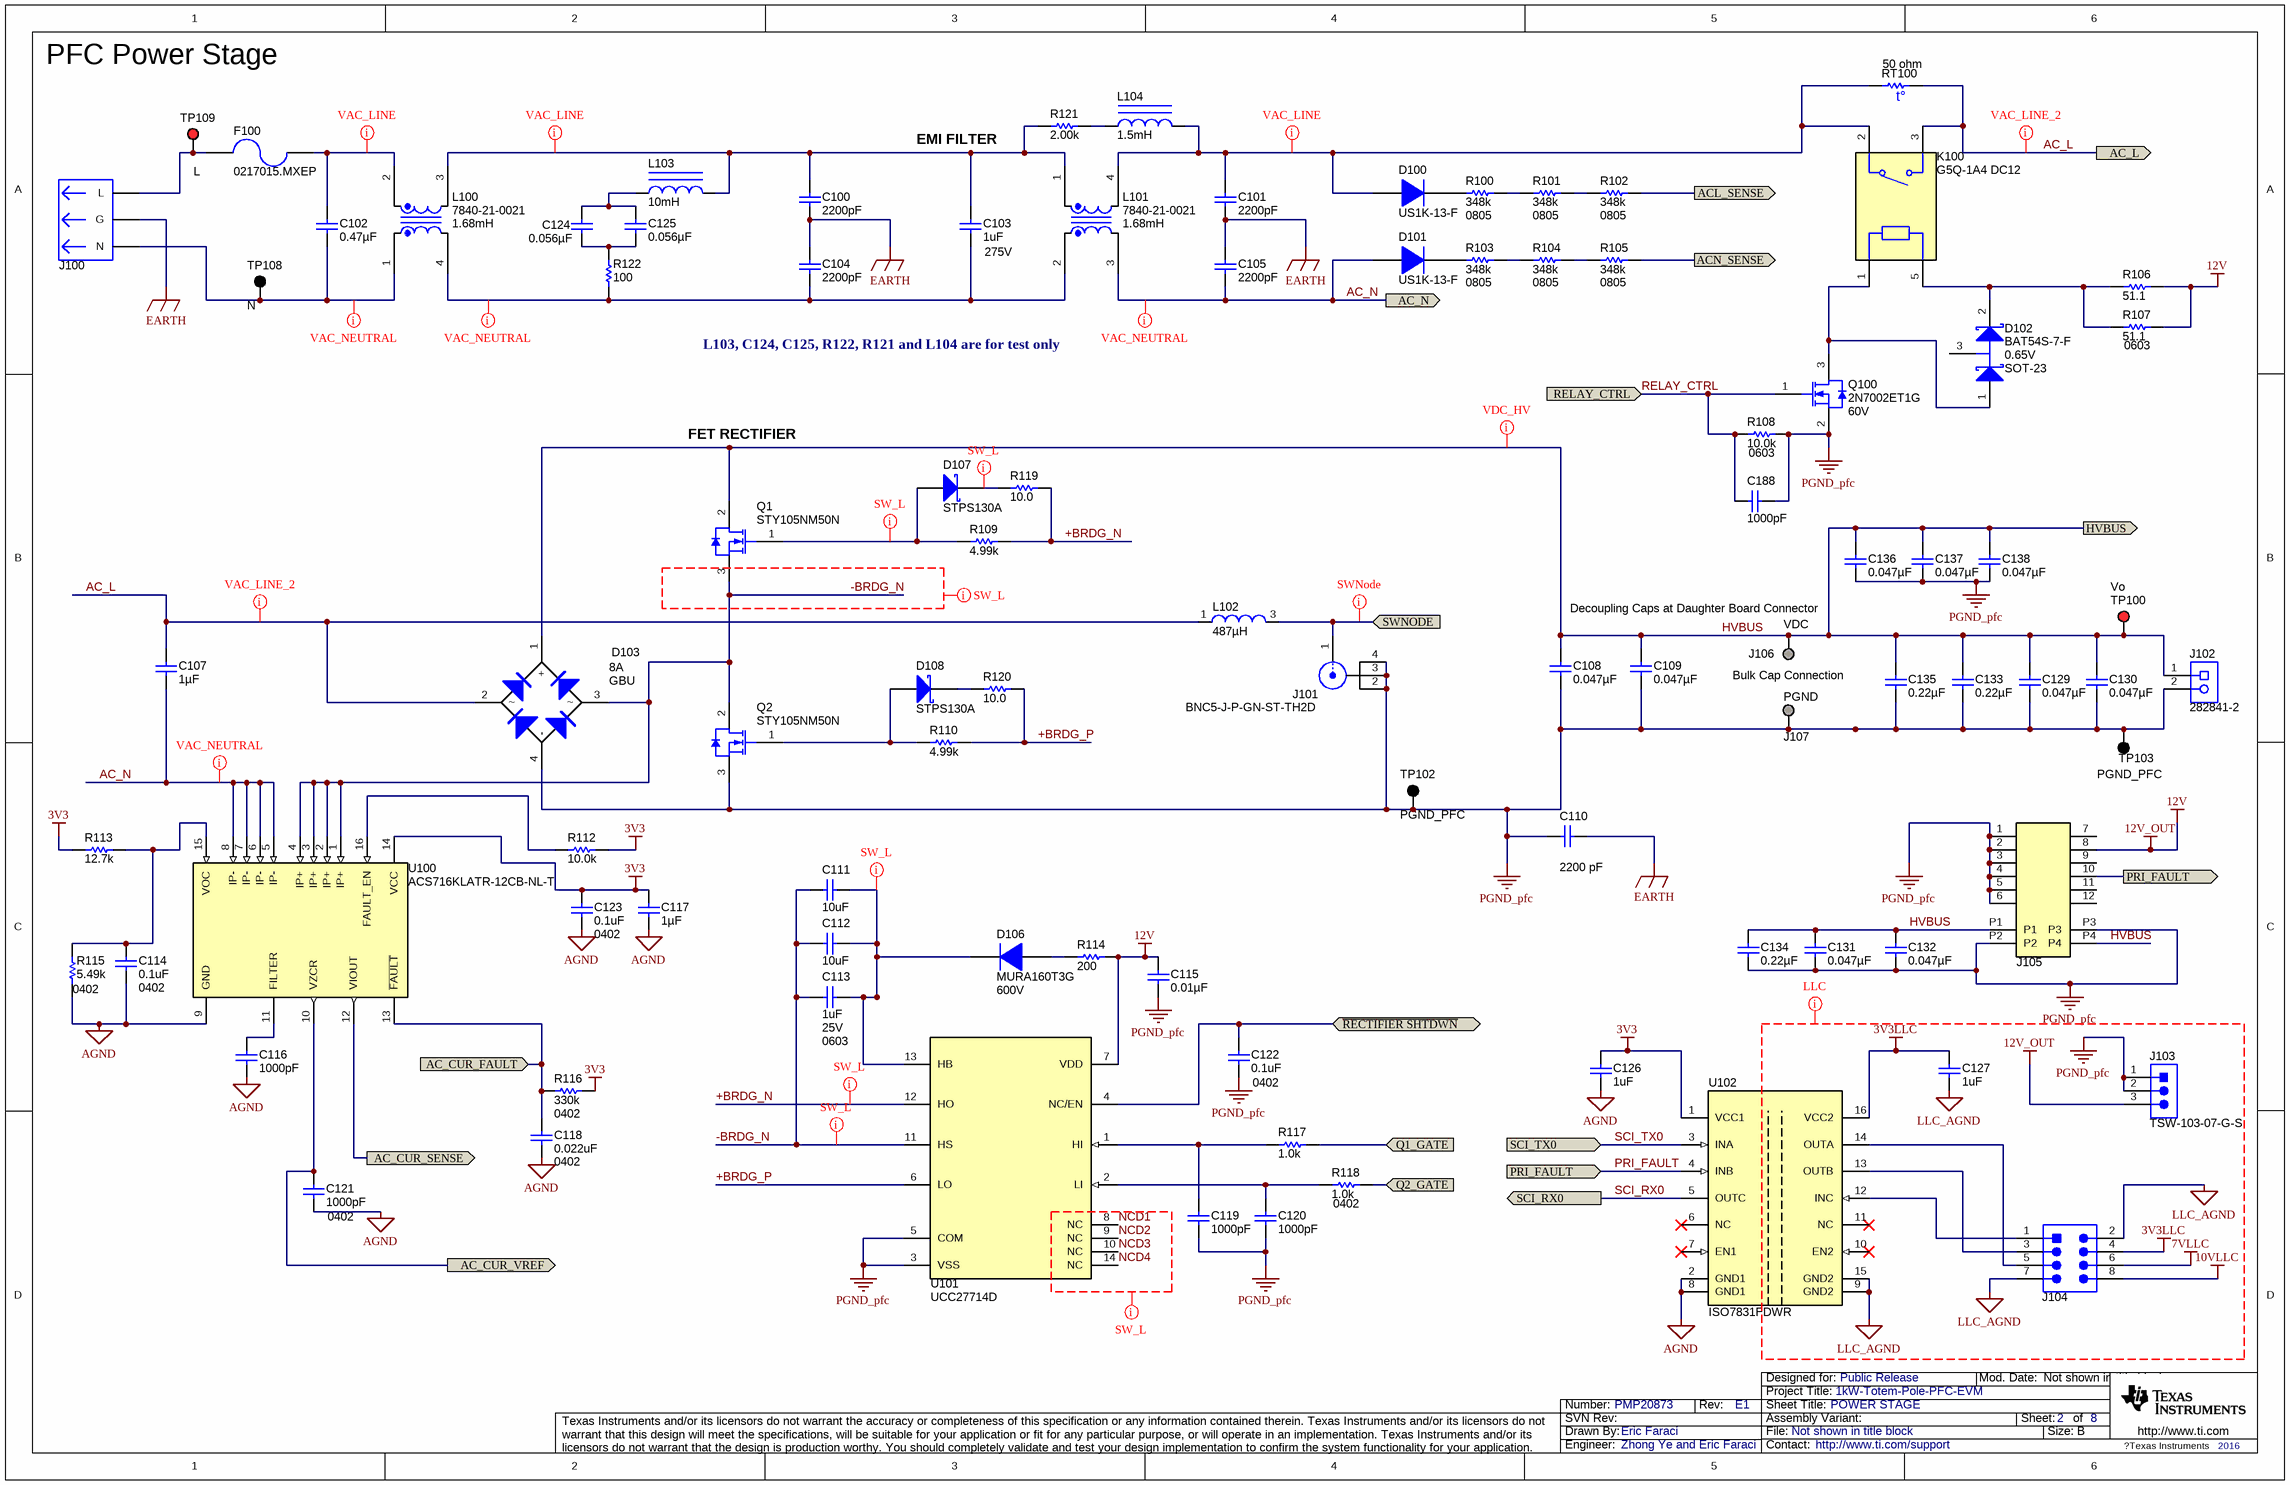
[diagram p3: PMP20873E1_Power.SchDoc]